# EAGLE board shield (EAGLE 9.3.0)
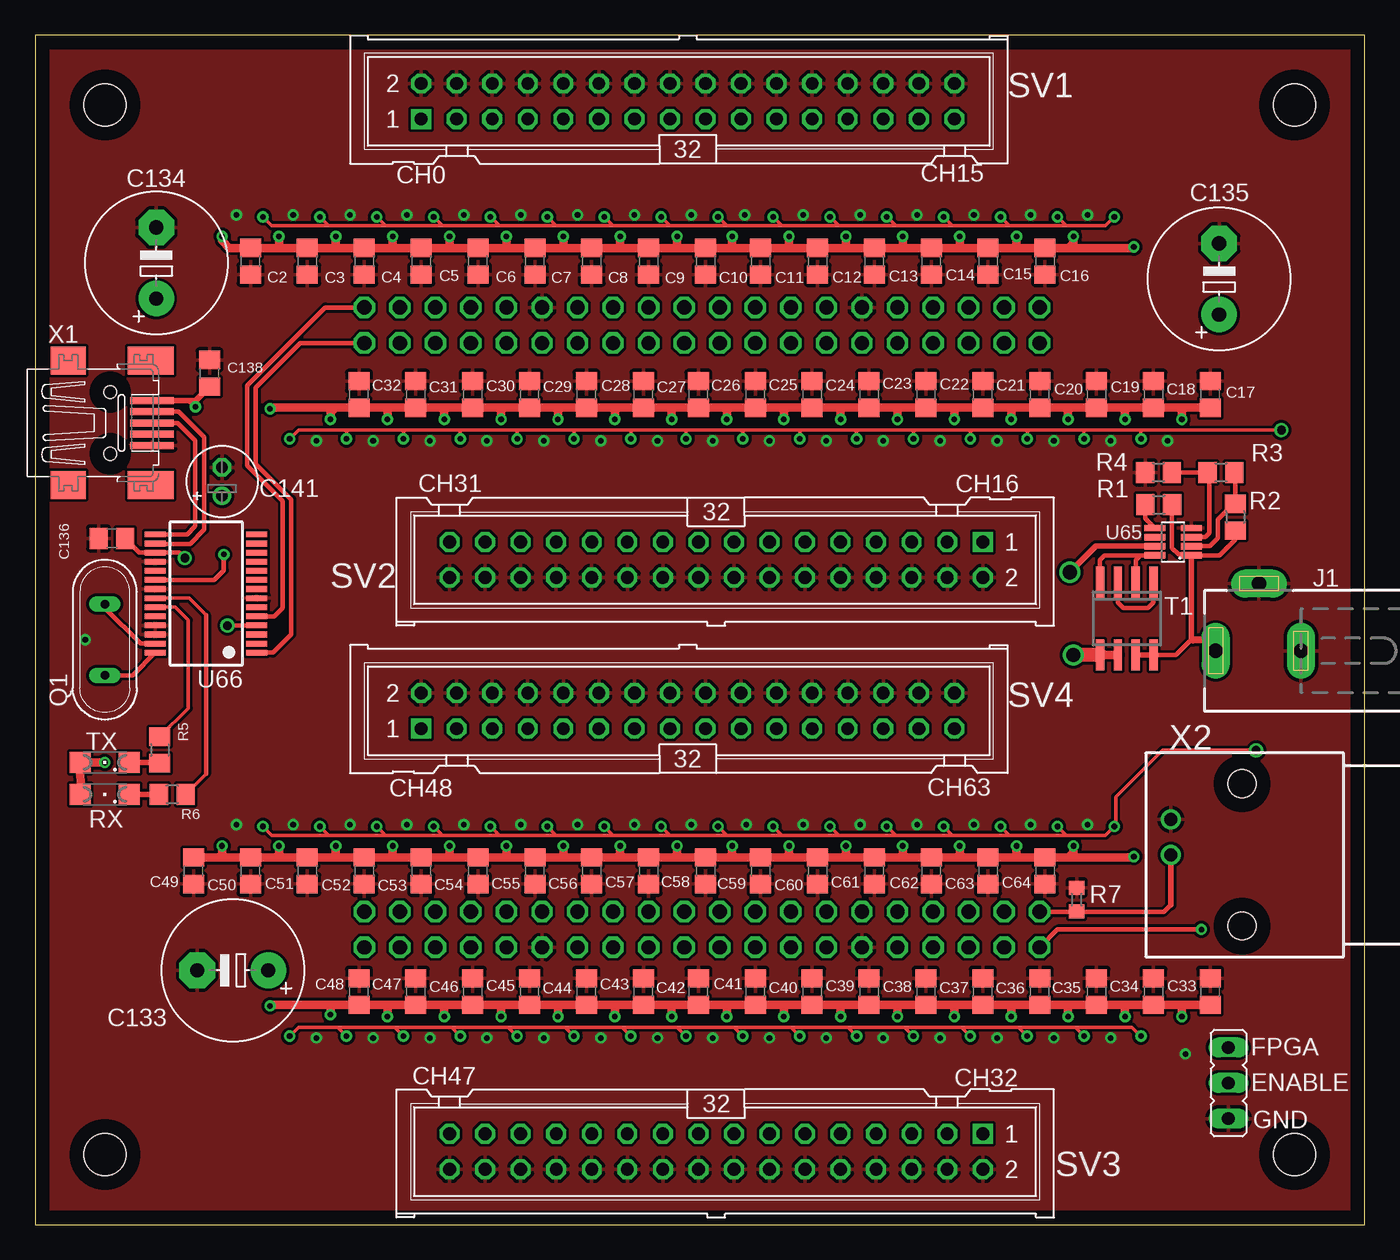
[diagram p5: board, top side]
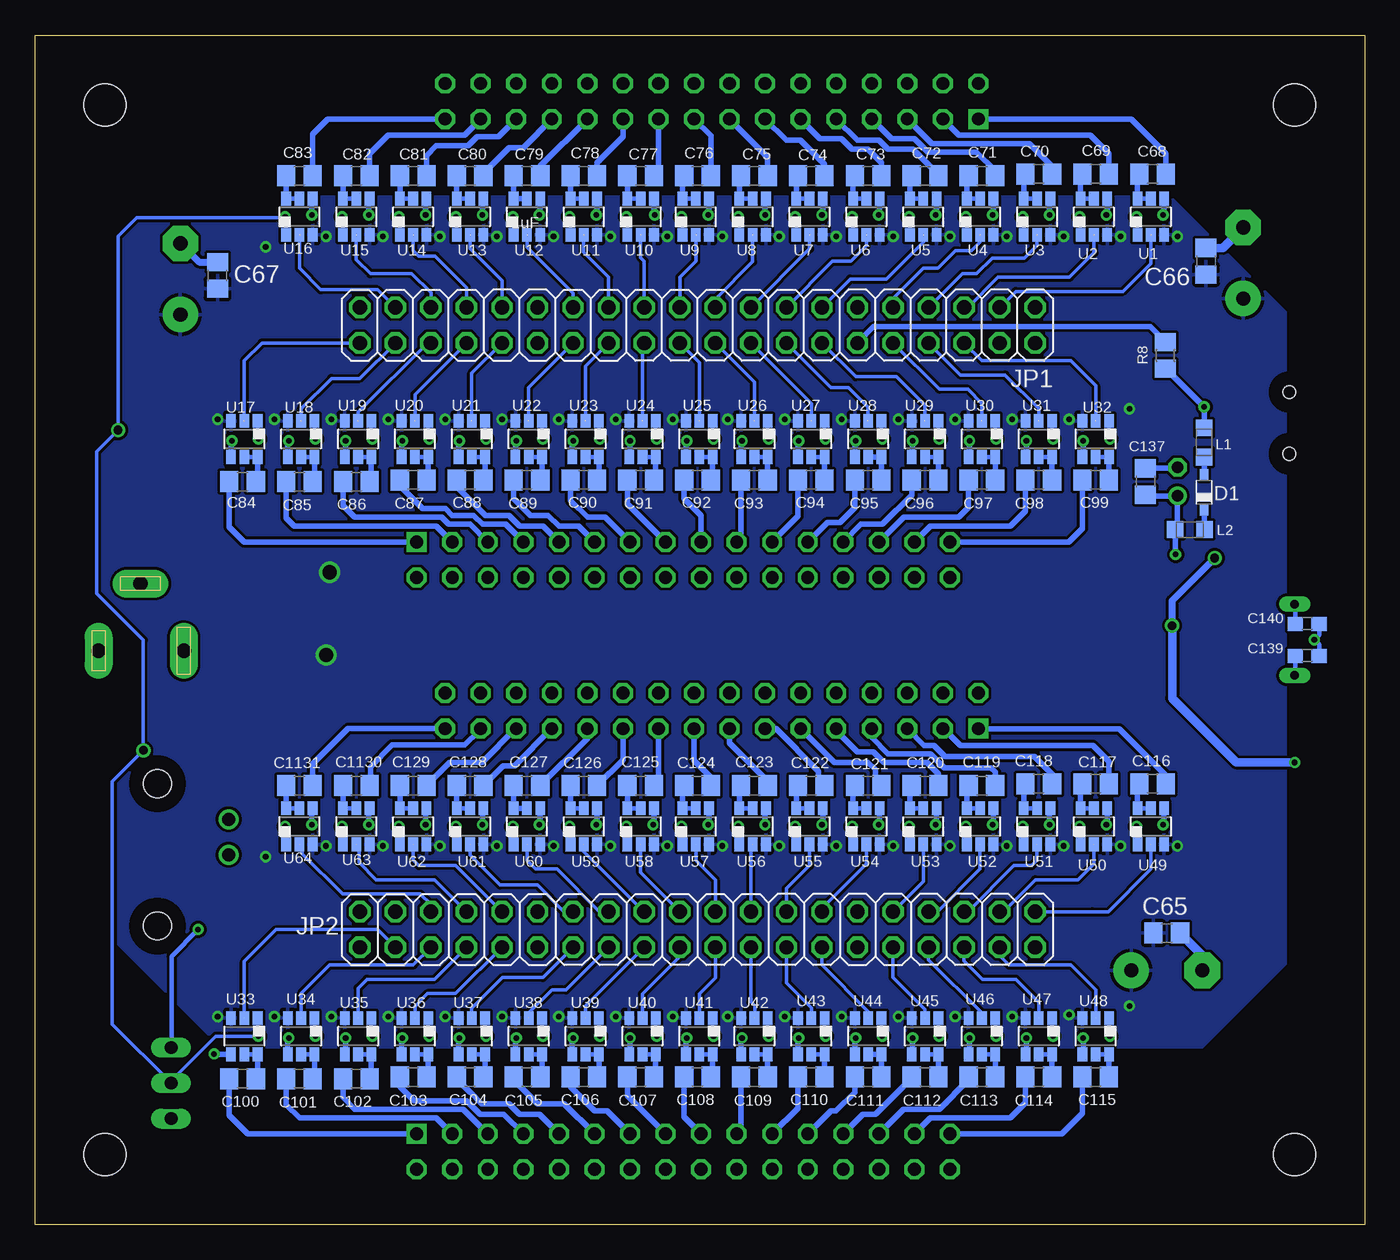
[diagram p6: board, bottom side, seen from below]

Size 95 x 85 mm. Coordinates in mm from the lower left corner, seen from the top.
Outline: 0,0 95,0 95,85 0,85 0,0
Copper layers (1*16): Top 0.035mm / dielectric 1.5mm / Bottom 0.035mm
Design rules "default *": minimum track width 6mil, minimum drill 0.35mm, track to track 8mil, track to pad 8mil, pad to pad 6mil, via to via 8mil, smd to smd 6mil, copper to edge 40mil, drill to drill 6mil, minimum pad ring 10mil, minimum via ring 8mil, stop-mask expansion 4mil, vias tented up to drill 0mil, thermal gap 10mil
Holes 3 mm at 5,5 5,80 90,80 90,5

## Footprints (pad centres in the part's own frame; a part is rotated, then mirrored left to right if it is on the bottom)
C0805 = smd 1.3 x 1.5: 1 -0.95,0; 2 0.95,0
E5-10,5 = drill 1.016 pad 2.54: + -2.54,0 | drill 1.016 pad 2.54 octagon: - 2.54,0
C0603 = smd 1.1 x 1: 1 -0.85,0; 2 0.85,0
E2-5 = drill 0.813 pad 1.27: + -1.016,0 | drill 0.813 pad 1.27 octagon: - 1.016,0
SOD323_ST = smd 0.8 x 0.6: A 1.25,0; C -1.25,0
DCJ0202 = drill 1.016 pad 2 long: 1 0,3.1; 2 4.8,0; 3 0,-3
2X20 = drill 1.016 octagon: 1 -24.13,-1.27; 2 -24.13,1.27; 3 -21.59,-1.27; 4 -21.59,1.27; 5 -19.05,-1.27; 6 -19.05,1.27; 7 -16.51,-1.27; 8 -16.51,1.27; 9 -13.97,-1.27; 10 -13.97,1.27; 11 -11.43,-1.27; 12 -11.43,1.27; 13 -8.89,-1.27; 14 -8.89,1.27; 15 -6.35,-1.27; 16 -6.35,1.27; 17 -3.81,-1.27; 18 -3.81,1.27; 19 -1.27,-1.27; 20 -1.27,1.27; 21 1.27,-1.27; 22 1.27,1.27; 23 3.81,-1.27; 24 3.81,1.27; 25 6.35,-1.27; 26 6.35,1.27; 27 8.89,-1.27; 28 8.89,1.27; 29 11.43,-1.27; 30 11.43,1.27; 31 13.97,-1.27; 32 13.97,1.27; 33 16.51,-1.27; 34 16.51,1.27; 35 19.05,-1.27; 36 19.05,1.27; 37 21.59,-1.27; 38 21.59,1.27; 39 24.13,-1.27; 40 24.13,1.27
JP2 = drill 0.914 long: 1 -2.54,0; 2 0,0; 3 2.54,0
SML0805 = smd 1.2 x 1.2: A 1.05,0; C -1.05,0
SML1206 = smd 1.5 x 1.5: A 1.75,0; C -1.75,0
QS = drill 0.61 long: 1 -2.54,0; 2 2.54,0
R0805 = smd 1.3 x 1.5: 1 -0.95,0; 2 0.95,0
R0603 = smd 1 x 1.1: 1 -0.85,0; 2 0.85,0
ML32 = drill 0.914 square: 1 -19.05,-1.27 | drill 0.914 octagon: 2 -19.05,1.27; 3 -16.51,-1.27; 4 -16.51,1.27; 5 -13.97,-1.27; 6 -13.97,1.27; 7 -11.43,-1.27; 8 -11.43,1.27; 9 -8.89,-1.27; 10 -8.89,1.27; 11 -6.35,-1.27; 12 -6.35,1.27; 13 -3.81,-1.27; 14 -3.81,1.27; 15 -1.27,-1.27; 16 -1.27,1.27; 17 1.27,-1.27; 18 1.27,1.27; 19 3.81,-1.27; 20 3.81,1.27; 21 6.35,-1.27; 22 6.35,1.27; 23 8.89,-1.27; 24 8.89,1.27; 25 11.43,-1.27; 26 11.43,1.27; 27 13.97,-1.27; 28 13.97,1.27; 29 16.51,-1.27; 30 16.51,1.27; 31 19.05,-1.27; 32 19.05,1.27
SO8 = smd 0.6 x 2.2: 1 -1.905,-2.6; 2 -0.635,-2.6; 3 0.635,-2.6; 4 1.905,-2.6; 5 1.905,2.6; 6 0.635,2.6; 7 -0.635,2.6; 8 -1.905,2.6
DBV_R-PDSO-G6 = smd 0.69 x 0.99: 1 -0.95,-1.29; 2 0,-1.29; 3 0.95,-1.29; 4 0.95,1.3; 5 0,1.3; 6 -0.95,1.3
TSOT23-8 = smd 0.457 x 1.499: 1 -0.95,-1.3; 2 -0.3,-1.3; 3 0.35,-1.3; 4 1,-1.3; 5 1,1.3; 6 0.35,1.3; 7 -0.3,1.3; 8 -0.95,1.3
SSOP28 = smd 0.4 x 1.5: 1 -4.225,-3.625; 2 -3.575,-3.625; 3 -2.925,-3.625; 4 -2.275,-3.625; 5 -1.625,-3.625; 6 -0.975,-3.625; 7 -0.325,-3.625; 8 0.325,-3.625; 9 0.975,-3.625; 10 1.625,-3.625; 11 2.275,-3.625; 12 2.925,-3.625; 13 3.575,-3.625; 14 4.225,-3.625; 15 4.225,3.625; 16 3.575,3.625; 17 2.925,3.625; 18 2.275,3.625; 19 1.625,3.625; 20 0.975,3.625; 21 0.325,3.625; 22 -0.325,3.625; 23 -0.975,3.625; 24 -1.625,3.625; 25 -2.275,3.625; 26 -2.925,3.625; 27 -3.575,3.625; 28 -4.225,3.625
32005-201 = smd 3.1 x 0.5: 1 3,1.6; 2 3,0.8; 3 3,0; 4 3,-0.8; 5 3,-1.6 | smd 2.5 x 2: M1 -3,-4.45; M2 -3,4.45 | smd 3.3 x 2: M3 2.9,4.45; M4 2.9,-4.45 | hole 0.914: 0,2.2; 0,-2.2
BNC_CUSTOM = drill 0.914 pad 1.27: 1 0,-5.08; 2 -2.54,-5.08 | hole 2: -5.08,0; 5.08,0

## Placement (x,y rotation side)
C2  1uF  [C0805]  15.4,68.83 270 top
C3  1uF  [C0805]  19.46,68.83 270 top
C4  1uF  [C0805]  23.53,68.83 270 top
C5  1uF  [C0805]  27.59,68.83 270 top
C6  1uF  [C0805]  31.66,68.83 270 top
C7  1uF  [C0805]  35.72,68.83 270 top
C8  1uF  [C0805]  39.78,68.83 270 top
C9  1uF  [C0805]  43.85,68.83 270 top
C10  1uF  [C0805]  47.91,68.83 270 top
C11  1uF  [C0805]  51.85,68.83 270 top
C12  1uF  [C0805]  55.91,68.83 270 top
C13  1uF  [C0805]  59.98,68.83 270 top
C14  1uF  [C0805]  64.04,68.83 270 top
C15  1uF  [C0805]  68.11,68.83 270 top
C16  1uF  [C0805]  72.17,68.83 270 top
C17  1uF  [C0805]  83.98,59.31 90 top
C18  1uF  [C0805]  79.92,59.31 90 top
C19  1uF  [C0805]  75.85,59.31 90 top
C20  1uF  [C0805]  71.79,59.31 90 top
C21  1uF  [C0805]  67.72,59.31 90 top
C22  1uF  [C0805]  63.66,59.31 90 top
C23  1uF  [C0805]  59.6,59.31 90 top
C24  1uF  [C0805]  55.53,59.31 90 top
C25  1uF  [C0805]  51.47,59.31 90 top
C26  1uF  [C0805]  47.4,59.31 90 top
C27  1uF  [C0805]  43.47,59.31 90 top
C28  1uF  [C0805]  39.4,59.31 90 top
C29  1uF  [C0805]  35.34,59.31 90 top
C30  1uF  [C0805]  31.27,59.31 90 top
C31  1uF  [C0805]  27.21,59.31 90 top
C32  1uF  [C0805]  23.15,59.31 90 top
C33  1uF  [C0805]  83.98,16.64 90 top
C34  1uF  [C0805]  79.92,16.64 90 top
C35  1uF  [C0805]  75.85,16.64 90 top
C36  1uF  [C0805]  71.79,16.64 90 top
C37  1uF  [C0805]  67.72,16.64 90 top
C38  1uF  [C0805]  63.66,16.64 90 top
C39  1uF  [C0805]  59.6,16.64 90 top
C40  1uF  [C0805]  55.53,16.64 90 top
C41  1uF  [C0805]  51.47,16.64 90 top
C42  1uF  [C0805]  47.4,16.64 90 top
C43  1uF  [C0805]  43.47,16.64 90 top
C44  1uF  [C0805]  39.4,16.64 90 top
C45  1uF  [C0805]  35.34,16.64 90 top
C46  1uF  [C0805]  31.27,16.64 90 top
C47  1uF  [C0805]  27.21,16.64 90 top
C48  1uF  [C0805]  23.15,16.64 90 top
C49  1uF  [C0805]  11.34,25.27 270 top
C50  1uF  [C0805]  15.4,25.27 270 top
C51  1uF  [C0805]  19.46,25.27 270 top
C52  1uF  [C0805]  23.53,25.27 270 top
C53  1uF  [C0805]  27.59,25.27 270 top
C54  1uF  [C0805]  31.66,25.27 270 top
C55  1uF  [C0805]  35.72,25.27 270 top
C56  1uF  [C0805]  39.78,25.27 270 top
C57  1uF  [C0805]  43.85,25.27 270 top
C58  1uF  [C0805]  47.91,25.27 270 top
C59  1uF  [C0805]  51.85,25.27 270 top
C60  1uF  [C0805]  55.91,25.27 270 top
C61  1uF  [C0805]  59.98,25.27 270 top
C62  1uF  [C0805]  64.04,25.27 270 top
C63  1uF  [C0805]  68.11,25.27 270 top
C64  1uF  [C0805]  72.17,25.27 270 top
C65  1uF  [C0805]  14.13,20.83 0 bottom
C66  1uF  [C0805]  11.34,68.83 90 bottom
C67  1uF  [C0805]  81.95,67.82 90 bottom
C68  [C0805]  15.15,75.06 0 bottom
C69  [C0805]  19.21,75.06 0 bottom
C70  [C0805]  23.27,75.06 0 bottom
C71  [C0805]  27.34,74.93 0 bottom
C72  [C0805]  31.4,74.93 0 bottom
C73  [C0805]  35.47,74.93 0 bottom
C74  [C0805]  39.53,74.93 0 bottom
C75  [C0805]  43.59,74.93 0 bottom
C76  [C0805]  47.66,74.93 0 bottom
C77  [C0805]  51.72,74.93 0 bottom
C78  [C0805]  55.79,74.93 0 bottom
C79  [C0805]  59.85,74.93 0 bottom
C80  [C0805]  63.91,74.93 0 bottom
C81  [C0805]  67.98,74.93 0 bottom
C82  [C0805]  72.04,74.93 0 bottom
C83  [C0805]  76.11,74.93 0 bottom
C84  [C0805]  80.17,53.09 180 bottom
C85  [C0805]  76.11,53.09 180 bottom
C86  [C0805]  72.04,53.09 180 bottom
C87  [C0805]  67.98,53.21 180 bottom
C88  [C0805]  63.91,53.21 180 bottom
C89  [C0805]  59.85,53.21 180 bottom
C90  [C0805]  55.79,53.21 180 bottom
C91  [C0805]  51.72,53.21 180 bottom
C92  [C0805]  47.66,53.21 180 bottom
C93  [C0805]  43.59,53.21 180 bottom
C94  [C0805]  39.53,53.21 180 bottom
C95  [C0805]  35.47,53.21 180 bottom
C96  [C0805]  31.4,53.21 180 bottom
C97  [C0805]  27.34,53.21 180 bottom
C98  [C0805]  23.27,53.21 180 bottom
C99  [C0805]  19.21,53.21 180 bottom
C100  [C0805]  80.17,10.41 180 bottom
C101  [C0805]  76.11,10.41 180 bottom
C102  [C0805]  72.04,10.41 180 bottom
C103  [C0805]  67.98,10.54 180 bottom
C104  [C0805]  63.91,10.54 180 bottom
C105  [C0805]  59.85,10.54 180 bottom
C106  [C0805]  55.79,10.54 180 bottom
C107  [C0805]  51.72,10.54 180 bottom
C108  [C0805]  47.66,10.54 180 bottom
C109  [C0805]  43.59,10.54 180 bottom
C110  [C0805]  39.53,10.54 180 bottom
C111  [C0805]  35.47,10.54 180 bottom
C112  [C0805]  31.4,10.54 180 bottom
C113  [C0805]  27.34,10.54 180 bottom
C114  [C0805]  23.27,10.54 180 bottom
C115  [C0805]  19.21,10.54 180 bottom
C116  [C0805]  15.15,31.5 0 bottom
C117  [C0805]  19.21,31.5 0 bottom
C118  [C0805]  23.27,31.5 0 bottom
C119  [C0805]  27.34,31.37 0 bottom
C120  [C0805]  31.4,31.37 0 bottom
C121  [C0805]  35.47,31.37 0 bottom
C122  [C0805]  39.53,31.37 0 bottom
C123  [C0805]  43.59,31.37 0 bottom
C124  [C0805]  47.66,31.37 0 bottom
C125  [C0805]  51.72,31.37 0 bottom
C126  [C0805]  55.79,31.37 0 bottom
C127  [C0805]  59.85,31.37 0 bottom
C128  [C0805]  63.91,31.37 0 bottom
C129  [C0805]  67.98,31.37 0 bottom
C133  220uF  [E5-10,5]  14.13,18.16 180 top
C134  220uF  [E5-10,5]  8.67,68.71 90 top
C135  220uF  [E5-10,5]  84.61,67.56 90 top
C136  100nF  [C0805]  5.49,49.02 180 top
C137  100nF  [C0805]  15.65,53.09 90 bottom
C138  10nF  [C0805]  12.48,60.83 90 top
C139  18pF  [C0603]  4.1,40.64 0 bottom
C140  18pF  [C0603]  4.1,42.93 0 bottom
C141  4.7uF  [E2-5]  13.37,53.09 90 top
C1130  [C0805]  72.04,31.37 0 bottom
C1131  [C0805]  76.11,31.37 0 bottom
D1  BAT60J  [SOD323_ST]  11.46,52.32 90 bottom
J1  DC_JACK  [DCJ0202]  87.46,41 90 top
JP1  [2X20]  47.66,64.26 180 bottom
JP2  [2X20]  47.66,21.08 0 bottom
JUMPER  JUMPER_3  [JP2]  85.28,10.11 90 top
L1  FERRITE  [SML0805]  11.46,55.88 90 bottom
L2  POLYFUSE  [SML0805]  12.48,49.66 0 bottom
LED1  [SML1206]  4.99,33.02 180 top
LED2  [SML1206]  4.99,30.73 180 top
Q1  12 MHz  [QS]  4.99,41.78 270 top
R1  510k  [R0805]  80.3,51.44 0 top
R2  2M1  [R0805]  85.76,50.55 270 top
R3  168k  [R0805]  84.74,53.75 0 top
R4  59k  [R0805]  80.27,53.75 0 top
R5  65R  [R0805]  8.92,33.91 270 top
R6  65R  [R0805]  9.81,30.73 180 top
R7  50R  [R0603]  74.43,23.22 90 top
R8  0R  [R0805]  14.22,62.1 90 bottom
SV1  ML32  [ML32]  46.64,80.26 0 top
SV2  ML32  [ML32]  48.67,47.5 180 top
SV3  ML32  [ML32]  48.67,5.21 180 top
SV4  ML32  [ML32]  46.64,36.7 0 top
T1  PHKD3NQ10T  [SO8]  78.01,43.31 180 top
U1  UCC27531  [DBV_R-PDSO-G6]  15.27,72.01 0 bottom
U2  UCC27531  [DBV_R-PDSO-G6]  19.34,72.01 0 bottom
U3  UCC27531  [DBV_R-PDSO-G6]  23.4,72.01 0 bottom
U4  UCC27531  [DBV_R-PDSO-G6]  27.46,72.01 0 bottom
U5  UCC27531  [DBV_R-PDSO-G6]  31.53,72.01 0 bottom
U6  UCC27531  [DBV_R-PDSO-G6]  35.59,72.01 0 bottom
U7  UCC27531  [DBV_R-PDSO-G6]  39.66,72.01 0 bottom
U8  UCC27531  [DBV_R-PDSO-G6]  43.72,72.01 0 bottom
U9  UCC27531  [DBV_R-PDSO-G6]  47.78,72.01 0 bottom
U10  UCC27531  [DBV_R-PDSO-G6]  51.72,72.01 0 bottom
U11  UCC27531  [DBV_R-PDSO-G6]  55.79,72.01 0 bottom
U12  UCC27531  [DBV_R-PDSO-G6]  59.85,72.01 0 bottom
U13  UCC27531  [DBV_R-PDSO-G6]  63.91,72.01 0 bottom
U14  UCC27531  [DBV_R-PDSO-G6]  67.98,72.01 0 bottom
U15  UCC27531  [DBV_R-PDSO-G6]  72.04,72.01 0 bottom
U16  UCC27531  [DBV_R-PDSO-G6]  76.11,72.01 0 bottom
U17  UCC27531  [DBV_R-PDSO-G6]  80.04,56.13 180 bottom
U18  UCC27531  [DBV_R-PDSO-G6]  75.98,56.13 180 bottom
U19  UCC27531  [DBV_R-PDSO-G6]  71.92,56.13 180 bottom
U20  UCC27531  [DBV_R-PDSO-G6]  67.85,56.13 180 bottom
U21  UCC27531  [DBV_R-PDSO-G6]  63.79,56.13 180 bottom
U22  UCC27531  [DBV_R-PDSO-G6]  59.72,56.13 180 bottom
U23  UCC27531  [DBV_R-PDSO-G6]  55.66,56.13 180 bottom
U24  UCC27531  [DBV_R-PDSO-G6]  51.59,56.13 180 bottom
U25  UCC27531  [DBV_R-PDSO-G6]  47.53,56.13 180 bottom
U26  UCC27531  [DBV_R-PDSO-G6]  43.59,56.13 180 bottom
U27  UCC27531  [DBV_R-PDSO-G6]  39.53,56.13 180 bottom
U28  UCC27531  [DBV_R-PDSO-G6]  35.47,56.13 180 bottom
U29  UCC27531  [DBV_R-PDSO-G6]  31.4,56.13 180 bottom
U30  UCC27531  [DBV_R-PDSO-G6]  27.34,56.13 180 bottom
U31  UCC27531  [DBV_R-PDSO-G6]  23.27,56.13 180 bottom
U32  UCC27531  [DBV_R-PDSO-G6]  19.21,56.13 180 bottom
U33  UCC27531  [DBV_R-PDSO-G6]  80.04,13.46 180 bottom
U34  UCC27531  [DBV_R-PDSO-G6]  75.98,13.46 180 bottom
U35  UCC27531  [DBV_R-PDSO-G6]  71.92,13.46 180 bottom
U36  UCC27531  [DBV_R-PDSO-G6]  67.85,13.46 180 bottom
U37  UCC27531  [DBV_R-PDSO-G6]  63.79,13.46 180 bottom
U38  UCC27531  [DBV_R-PDSO-G6]  59.72,13.46 180 bottom
U39  UCC27531  [DBV_R-PDSO-G6]  55.66,13.46 180 bottom
U40  UCC27531  [DBV_R-PDSO-G6]  51.59,13.46 180 bottom
U41  UCC27531  [DBV_R-PDSO-G6]  47.53,13.46 180 bottom
U42  UCC27531  [DBV_R-PDSO-G6]  43.59,13.46 180 bottom
U43  UCC27531  [DBV_R-PDSO-G6]  39.53,13.46 180 bottom
U44  UCC27531  [DBV_R-PDSO-G6]  35.47,13.46 180 bottom
U45  UCC27531  [DBV_R-PDSO-G6]  31.4,13.46 180 bottom
U46  UCC27531  [DBV_R-PDSO-G6]  27.34,13.46 180 bottom
U47  UCC27531  [DBV_R-PDSO-G6]  23.27,13.46 180 bottom
U48  UCC27531  [DBV_R-PDSO-G6]  19.21,13.46 180 bottom
U49  UCC27531  [DBV_R-PDSO-G6]  15.27,28.45 0 bottom
U50  UCC27531  [DBV_R-PDSO-G6]  19.34,28.45 0 bottom
U51  UCC27531  [DBV_R-PDSO-G6]  23.4,28.45 0 bottom
U52  UCC27531  [DBV_R-PDSO-G6]  27.46,28.45 0 bottom
U53  UCC27531  [DBV_R-PDSO-G6]  31.53,28.45 0 bottom
U54  UCC27531  [DBV_R-PDSO-G6]  35.59,28.45 0 bottom
U55  UCC27531  [DBV_R-PDSO-G6]  39.66,28.45 0 bottom
U56  UCC27531  [DBV_R-PDSO-G6]  43.72,28.45 0 bottom
U57  UCC27531  [DBV_R-PDSO-G6]  47.78,28.45 0 bottom
U58  UCC27531  [DBV_R-PDSO-G6]  51.72,28.45 0 bottom
U59  UCC27531  [DBV_R-PDSO-G6]  55.79,28.45 0 bottom
U60  UCC27531  [DBV_R-PDSO-G6]  59.85,28.45 0 bottom
U61  UCC27531  [DBV_R-PDSO-G6]  63.91,28.45 0 bottom
U62  UCC27531  [DBV_R-PDSO-G6]  67.98,28.45 0 bottom
U63  UCC27531  [DBV_R-PDSO-G6]  72.04,28.45 0 bottom
U64  UCC27531  [DBV_R-PDSO-G6]  76.11,28.45 0 bottom
U65  LTC4365  [TSOT23-8]  81.31,48.77 90 top
U66  FT232R  [SSOP28]  12.22,45.09 90 top
X1  MINI-USB  [32005-201]  5.37,57.28 0 top
X2  BNC  [BNC_CUSTOM]  86.24,26.42 270 top

## Tracks (layer width: path | path; a pad name or v marks a point on that pad's centre or on a via)
3V3  (via drill 0.4, 0.61)
  Top 0.305: v10.7,47.62 10.32,48.01 U66.17 7.46,48.01 C136.1 | v13.75,42.8 15.84,42.8 U66.4
  Top 0.61: LED2.A 3.26,30.76 LED1.A v4.99,33.02
  Bottom 0.508: v13.75,42.8 13.75,44.58 v10.7,47.62
  Bottom 0.61: v13.75,42.8 13.75,37.59 9.18,33.02 v4.99,33.02
!RXLED!
  Top 0.254: U66.22 11.03,44.76 12.22,43.56 | 12.22,32.2 R6.1
  Top 0.305: 12.22,43.56 12.22,32.2
!TXLED!
  Top 0.254: R5.1 10.96,36.89 10.96,43.18 10.03,44.11 U66.23
BNC
  Top 0.152: R7.1 72.21,22.37 72.19,22.35
  Top 0.305: JP2.2 72.19,22.35 80.68,22.35 81.16,22.84
  Top 0.406: 81.16,22.84 X2.1
D+
  Top 0.305: X1.3 10.19,57.28 11.46,56.01 11.46,49.91 10.86,49.31 U66.15
D-
  Top 0.305: X1.2 10.28,58.08 12.1,56.26 12.1,49.66 11.08,48.64 8.62,48.64 U66.16
ENABLE  (via drill 0.4 pad 0.61, 0.61)
  Top 0.254: 79.92,56.77 79.03,56.77 v79.03,56.13 | 79.92,56.77 81.5,56.77 v89.06,56.77 | v18.19,13.46 18.83,14.1 21.11,14.1 | v79.03,13.46 78.39,14.1 73.69,14.1 | 73.69,14.1 69.88,14.1 | 69.88,14.1 65.56,14.1 | 65.56,14.1 61.63,14.1 | 61.63,14.1 57.31,14.1 | 57.31,14.1 53.25,14.1 | 53.25,14.1 49.69,14.1 | 49.69,14.1 45.12,14.1 | 45.12,14.1 41.44,14.1 | 41.44,14.1 37.37,14.1 | 37.37,14.1 33.43,14.1 | 33.43,14.1 28.61,14.1 | 28.61,14.1 25.18,14.1 | 25.18,14.1 21.11,14.1 | v74.96,13.46 74.33,14.1 73.69,14.1 | v70.9,13.46 70.26,14.1 69.88,14.1 | v66.83,13.46 66.2,14.1 65.56,14.1 | v62.77,13.46 62.14,14.1 61.63,14.1 | v58.71,13.46 58.07,14.1 57.31,14.1 | v54.64,13.46 54.01,14.1 53.25,14.1 | v50.58,13.46 49.94,14.1 49.69,14.1 | v46.52,13.46 45.88,14.1 45.12,14.1 | v42.58,13.46 41.94,14.1 41.44,14.1 | v38.51,13.46 37.88,14.1 37.37,14.1 | v34.45,13.46 33.81,14.1 33.43,14.1 | v30.39,13.46 29.75,14.1 28.61,14.1 | v26.32,13.46 25.69,14.1 25.18,14.1 | v22.26,13.46 21.62,14.1 21.11,14.1 | v16.29,28.45 16.92,27.81 21.62,27.81 | 74.71,27.81 76.49,27.81 v77.12,28.45 77.22,28.55 77.22,30.56 80.58,33.91 87.23,33.91 v87.26,33.88 | 74.71,27.81 70.26,27.81 | 70.26,27.81 66.71,27.81 | 66.71,27.81 62.14,27.81 | 62.14,27.81 58.07,27.81 | 58.07,27.81 54.39,27.81 | 54.39,27.81 49.69,27.81 | 49.69,27.81 46.39,27.81 | 46.39,27.81 41.69,27.81 | 41.69,27.81 37.62,27.81 | 37.62,27.81 33.69,27.81 | 33.69,27.81 29.37,27.81 | 29.37,27.81 25.69,27.81 | 25.69,27.81 25.16,27.81 21.62,27.81 | v20.35,28.45 20.99,27.81 21.62,27.81 | v24.42,28.45 25.05,27.81 25.69,27.81 | v28.48,28.45 29.12,27.81 29.37,27.81 | v32.55,28.45 33.18,27.81 33.69,27.81 | v36.61,28.45 37.24,27.81 37.62,27.81
  Top 0.254: v40.67,28.45 41.31,27.81 41.69,27.81 | v44.74,28.45 45.37,27.81 46.39,27.81 | v48.8,28.45 49.44,27.81 49.69,27.81 | v52.74,28.45 53.37,27.81 54.39,27.81 | v56.8,28.45 57.44,27.81 58.07,27.81 | v60.87,28.45 61.5,27.81 62.14,27.81 | v64.93,28.45 65.56,27.81 66.71,27.81 | v68.99,28.45 69.63,27.81 70.26,27.81 | v73.06,28.45 73.69,27.81 74.71,27.81 | v18.19,56.13 18.83,56.77 21.37,56.77 | 21.37,56.77 25.31,56.77 | 25.31,56.77 29.5,56.77 | 29.5,56.77 33.43,56.77 | 33.43,56.77 37.37,56.77 | 37.37,56.77 41.56,56.77 | 41.56,56.77 45.63,56.77 | 45.63,56.77 49.82,56.77 | 49.82,56.77 53.75,56.77 | 53.75,56.77 57.44,56.77 | 57.44,56.77 61.37,56.77 | 61.37,56.77 65.95,56.77 | 65.95,56.77 70.14,56.77 | 70.14,56.77 73.82,56.77 | 73.82,56.77 79.92,56.77 | v74.96,56.13 74.96,56.77 73.82,56.77 | v70.9,56.13 70.9,56.77 70.14,56.77 | v66.83,56.13 66.83,56.77 65.95,56.77 | v62.77,56.13 62.77,56.77 61.37,56.77 | v58.71,56.13 58.71,56.77 57.44,56.77 | v54.64,56.13 54.64,56.77 53.75,56.77 | 49.82,56.77 50.45,56.77 50.58,56.64 v50.58,56.13 | v46.52,56.13 46.52,56.77 45.63,56.77 | v42.58,56.13 42.58,56.77 41.56,56.77 | v38.51,56.13 38.51,56.77 37.37,56.77 | v34.45,56.13 34.45,56.77 33.43,56.77 | v30.39,56.13 30.39,56.77 29.5,56.77 | v26.32,56.13 26.32,56.77 25.31,56.77 | v22.26,56.13 22.26,56.77 21.37,56.77 | v77.12,72.01 76.49,71.37 73.95,71.37 | v16.29,72.01 16.92,71.37 21.5,71.37 | 73.95,71.37 70.01,71.37 | 70.01,71.37 66.07,71.37 | 66.07,71.37 61.88,71.37 | 61.88,71.37 58.07,71.37 | 58.07,71.37 53.75,71.37 | 53.75,71.37 49.69,71.37 | 49.69,71.37 46.01,71.37 | 46.01,71.37 41.94,71.37 | 41.94,71.37 37.88,71.37 | 37.88,71.37 33.56,71.37 | 33.56,71.37 29.62,71.37
  Top 0.254: 29.62,71.37 25.31,71.37 | 25.31,71.37 21.5,71.37 | v20.35,72.01 20.99,71.37 21.5,71.37 | v24.42,72.01 25.05,71.37 25.31,71.37 | v28.48,72.01 29.12,71.37 29.62,71.37 | v32.55,72.01 33.18,71.37 33.56,71.37 | v36.61,72.01 37.24,71.37 37.88,71.37 | v40.67,72.01 41.31,71.37 41.94,71.37 | v44.74,72.01 45.37,71.37 46.01,71.37 | v48.8,72.01 49.44,71.37 49.69,71.37 | v52.74,72.01 53.37,71.37 53.75,71.37 | v56.8,72.01 57.44,71.37 58.07,71.37 | v60.87,72.01 61.5,71.37 61.88,71.37 | v64.93,72.01 65.56,71.37 66.07,71.37 | v68.99,72.01 69.63,71.37 70.01,71.37 | v73.06,72.01 73.69,71.37 73.95,71.37
  Bottom 0.254: U54.1 36.54,28.38 v36.61,28.45 | U60.1 60.8,28.38 v60.87,28.45 | U62.1 68.93,28.38 v68.99,28.45 | U63.1 72.99,28.38 v73.06,28.45 | U64.1 77.06,28.38 v77.12,28.45 | U49.1 16.22,28.38 v16.29,28.45 | U50.1 20.29,28.38 v20.35,28.45 | U51.1 24.35,28.38 v24.42,28.45 | U52.1 28.41,28.38 v28.48,28.45 | U53.1 32.48,28.38 v32.55,28.45 | U55.1 40.61,28.38 v40.67,28.45 | U56.1 44.67,28.38 v44.74,28.45 | U57.1 48.73,28.38 v48.8,28.45 | U58.1 52.67,28.38 v52.74,28.45 | U59.1 56.74,28.38 v56.8,28.45 | U61.1 64.86,28.38 v64.93,28.45 | U38.1 58.77,13.53 v58.71,13.46 | U44.1 34.52,13.53 v34.45,13.46 | U46.1 26.39,13.53 v26.32,13.46 | U47.1 22.32,13.53 v22.26,13.46 | U48.1 18.26,13.53 v18.19,13.46 | U33.1 79.09,13.53 v79.03,13.46 82.08,13.46 85.28,10.26 JUMPER.2 89.48,14.31 89.48,31.66 v87.26,33.88 87.26,41.76 90.58,45.09 90.58,55.24 89.19,56.64 v89.06,56.77 89.06,70.61 88.81,70.87 87.73,71.94 77.06,71.94 | U34.1 75.03,13.53 v74.96,13.46 | U35.1 70.97,13.53 v70.9,13.46 | U36.1 66.9,13.53 v66.83,13.46 | U37.1 62.84,13.53 v62.77,13.46 | U39.1 54.71,13.53 v54.64,13.46 | U40.1 50.65,13.53 v50.58,13.46 | U41.1 46.58,13.53 v46.52,13.46 | U42.1 42.64,13.53 v42.58,13.46 | U43.1 38.58,13.53 v38.51,13.46 | U45.1 30.45,13.53 v30.39,13.46 | U22.1 58.77,56.2 v58.71,56.13 | U28.1 34.52,56.2 v34.45,56.13 | U30.1 26.39,56.2 v26.32,56.13 | U31.1 22.32,56.2 v22.26,56.13 | U32.1 18.26,56.2 v18.19,56.13 | U17.1 79.09,56.2 v79.03,56.13 | U18.1 75.03,56.2 v74.96,56.13 | U19.1 70.97,56.2 v70.9,56.13 | U20.1 66.9,56.2 v66.83,56.13 | U21.1 62.84,56.2 v62.77,56.13 | U23.1 54.71,56.2 v54.64,56.13 | U24.1 50.65,56.2 v50.58,56.13 | U25.1 46.58,56.2 v46.52,56.13
  Bottom 0.254: U26.1 42.64,56.2 v42.58,56.13 | U27.1 38.58,56.2 v38.51,56.13 | U29.1 30.45,56.2 v30.39,56.13 | U6.1 36.54,71.94 v36.61,72.01 | U12.1 60.8,71.94 v60.87,72.01 | U14.1 68.93,71.94 v68.99,72.01 | U15.1 72.99,71.94 v73.06,72.01 | U16.1 77.06,71.94 | 77.06,71.94 v77.12,72.01 | U1.1 16.22,71.94 v16.29,72.01 | U2.1 20.29,71.94 v20.35,72.01 | U3.1 24.35,71.94 v24.42,72.01 | U4.1 28.41,71.94 v28.48,72.01 | U5.1 32.48,71.94 v32.55,72.01 | U7.1 40.61,71.94 v40.67,72.01 | U8.1 44.67,71.94 v44.74,72.01 | U9.1 48.73,71.94 v48.8,72.01 | U10.1 52.67,71.94 v52.74,72.01 | U11.1 56.74,71.94 v56.8,72.01 | U13.1 64.86,71.94 v64.93,72.01
FPGA-EN  (via drill 0.4)
  Top 0.305: v83.34,21.08 73.06,21.08 JP2.1
  Bottom 0.305: v83.34,21.08 85.25,19.18 85.25,12.68 JUMPER.3
GND  (via drill 0.4, 0.4 pad 0.61)
  Bottom 0.305: C139.2 3.25,41.44 v3.59,41.78 3.25,42.12 C140.2
  Bottom 0.406: v75.22,28.57 75.22,29.69 U64.4 | v71.15,28.57 71.15,29.69 U63.4 | U62.4 arc-90 67.09,29.69 v67.09,28.57 | U61.4 arc-90 63.02,29.69 v63.02,28.57 | v54.9,28.57 arc-90 54.84,28.64 U59.4 | U60.4 58.9,28.64 v58.96,28.57 | U58.4 50.77,28.64 v50.83,28.57 | U57.4 46.84,28.64 v46.9,28.57 | U56.4 42.83,29.69 v42.83,28.57 | U55.4 38.71,28.64 v38.77,28.57 | U54.4 34.64,28.64 v34.7,28.57 | U53.4 30.58,28.64 v30.64,28.57 | U49.4 14.32,28.64 v14.38,28.57 | U50.4 18.39,28.64 v18.45,28.57 | U51.4 22.51,29.69 v22.51,28.57 | U52.4 26.52,28.64 v26.58,28.57 | v20.1,13.34 20.1,12.22 U48.4 | v24.16,13.34 24.16,12.22 U47.4 | U46.4 arc-90 28.23,12.22 v28.23,13.34 | U45.4 arc-90 32.29,12.22 v32.29,13.34 | v40.42,13.34 arc-90 40.48,13.27 U43.4 | U44.4 36.42,13.27 v36.35,13.34 | U42.4 44.54,13.27 v44.48,13.34 | U41.4 48.48,13.27 v48.42,13.34 | U40.4 52.48,12.22 v52.48,13.34 | U39.4 56.61,13.27 v56.55,13.34 | U38.4 60.67,13.27 v60.61,13.34 | U37.4 64.74,13.27 v64.68,13.34 | v82.2,12.19 82.17,12.16 U33.4 | U34.4 76.93,13.27 v76.87,13.34 | U35.4 72.8,12.22 v72.8,13.34 | U36.4 68.8,13.27 v68.74,13.34 | v20.1,56.01 20.1,54.9 U32.4 | v24.16,56.01 24.16,54.9 U31.4 | U30.4 arc-90 28.23,54.9 v28.23,56.01 | U29.4 arc-90 32.29,54.9 v32.29,56.01 | v40.42,56.01 arc-90 40.48,55.95 U27.4 | U28.4 36.42,55.95 v36.35,56.01 | U26.4 44.54,55.95 v44.48,56.01 | U25.4 48.48,55.95 v48.42,56.01 | U24.4 52.48,54.9 v52.48,56.01 | U23.4 56.61,55.95 v56.55,56.01 | U22.4 60.67,55.95 v60.61,56.01 | U21.4 64.74,55.95 v64.68,56.01 | U17.4 80.99,55.95 v80.93,56.01 | U18.4 76.93,55.95 v76.87,56.01 | U19.4 72.8,54.9 v72.8,56.01 | U20.4 68.8,55.95 v68.74,56.01 | v75.22,72.14 75.22,73.25 U16.4
  Bottom 0.406: v71.15,72.14 71.15,73.25 U15.4 | U14.4 arc-90 67.09,73.25 v67.09,72.14 | U13.4 arc-90 63.02,73.25 v63.02,72.14 | v54.9,72.14 arc-90 54.84,72.2 U11.4 | U12.4 58.9,72.2 v58.96,72.14 | U10.4 50.77,72.2 v50.71,72.14 | U9.4 46.84,72.2 v46.9,72.14 | U8.4 42.83,73.25 v42.83,72.14 | U7.4 38.71,72.2 v38.77,72.14 | U6.4 34.64,72.2 v34.7,72.14 | U5.4 30.58,72.2 v30.64,72.14 | U1.4 14.32,72.2 v14.38,72.14 | U2.4 18.39,72.2 v18.45,72.14 | U3.4 22.51,73.25 v22.51,72.14 | U4.4 26.52,72.2 v26.58,72.14 | C137.2 13.43,54.04 C141.-
  Bottom 0.508: C67.2 83.28,68.77 C135.-
  Bottom 0.61: C134.- 10.13,69.78 C66.2 | C133.- 11.59,19.24 C65.2
  pour Top: 0,0 95.05,0 95.05,85.36 0,85.36
IN0
  Bottom 0.254: U1.2 15.27,68.67 17.27,66.67 24.93,66.67 JP1.3
IN1
  Bottom 0.254: U2.2 19.34,69.44 21.08,67.69 26.2,67.69 28.35,65.53 JP1.5
IN2
  Bottom 0.254: U3.2 23.4,69.96 24.29,69.07 26.6,69.07 27.72,67.94 28.73,67.94 JP1.7
IN3
  Bottom 0.254: JP1.9 33.69,66.17 31.53,68.33 30.49,68.33 29.24,69.58 28.1,69.58 27.46,70.21 U4.2
IN4
  Bottom 0.254: JP1.13 36.74,67.56 34.18,67.56 31.53,70.21 U5.2
IN5
  Bottom 0.254: U6.2 35.59,69.94 36.7,68.83 38.01,68.83 JP1.15
IN6
  Bottom 0.254: JP1.17 39.66,69.72 U7.2
IN7
  Bottom 0.254: JP1.19 46.39,66.13 43.72,68.8 U8.2
IN8
  Bottom 0.254: U9.2 47.78,68.83 48.93,67.69 JP1.21
IN9
  Bottom 0.254: U10.2 51.72,69.09 51.47,68.83 JP1.23
IN10
  Bottom 0.254: U11.2 55.79,69.47 54.01,67.69 JP1.25
IN11
  Bottom 0.254: U12.2 59.85,69.85 56.55,66.55 JP1.27
IN12
  Bottom 0.254: U13.2 63.91,69.72 62.06,67.86 61.63,67.44 JP1.31
IN13
  Bottom 0.254: U14.2 67.98,69.6 67.58,69.2 66.4,69.2 64.17,66.96 JP1.33
IN14
  Bottom 0.254: U15.2 72.04,68.96 71.03,67.94 68.07,67.94 66.71,66.58 JP1.35
IN15
  Bottom 0.254: U16.2 76.11,68.33 74.58,66.8 71.37,66.8 70.52,66.8 JP1.37
IN16
  Bottom 0.254: JP1.40 78.77,62.99 80.04,61.72 U17.2
IN17
  Bottom 0.254: U18.2 75.98,58.29 73.82,60.45 71.79,60.45 JP1.38
IN18
  Bottom 0.254: U19.2 71.92,58.04 66.96,62.99 JP1.36
IN19
  Bottom 0.254: U20.2 67.85,59.31 JP1.34
IN20
  Bottom 0.254: U21.2 63.79,60.83 JP1.32
IN21
  Bottom 0.254: U22.2 59.72,59.82 JP1.28
IN22
  Bottom 0.254: U23.2 55.66,61.34 JP1.26
IN23
  Bottom 0.254: U24.2 51.59,62.87 JP1.24
IN24
  Bottom 0.254: U25.2 47.53,61.59 JP1.22
IN25
  Bottom 0.254: U26.2 43.59,60.2 JP1.20
IN26
  Bottom 0.254: U27.2 39.53,58.67 JP1.18
IN27
  Bottom 0.254: U28.2 35.47,58.42 36.86,59.82 38.13,59.82 JP1.16
IN28
  Bottom 0.254: U29.2 31.4,58.55 33.43,60.58 36.35,60.58 JP1.14
IN29
  Bottom 0.254: U30.2 27.34,58.67 28.35,59.69 30.39,59.69 JP1.10
IN30
  Bottom 0.254: JP1.8 28.86,60.71 25.69,60.71 23.27,58.29 U31.2
IN31
  Bottom 0.254: JP1.6 27.34,61.72 20.99,61.72 19.21,59.94 U32.2
IN32
  Bottom 0.254: U33.2 80.04,18.8 77.76,21.08 70.52,21.08 JP2.3
IN33
  Bottom 0.254: U34.2 75.98,16.51 73.95,18.54 67.98,18.54 JP2.5
IN34
  Bottom 0.254: U35.2 71.92,16.89 71.28,17.53 66.45,17.53 JP2.7
IN35
  Bottom 0.254: JP2.9 64.93,16.51 66.93,16.51 67.85,15.59 U36.2
IN36
  Bottom 0.254: JP2.13 58.71,17.65 61.59,17.65 63.79,15.46 U37.2
IN37
  Bottom 0.254: JP2.15 57.06,16.76 58.07,16.76 59.72,15.11 U38.2
IN38
  Bottom 0.254: U39.2 55.66,15.37 55.66,15.62 JP2.17
IN39
  Bottom 0.254: JP2.19 48.93,19.14 51.59,16.48 U40.2
IN40
  Bottom 0.254: JP2.21 46.39,17.62 47.53,16.48 U41.2
IN41
  Bottom 0.254: JP2.23 43.85,15.91 43.56,15.62 43.56,14.79 U42.2
IN42
  Bottom 0.254: U43.2 39.53,15.49 41.31,17.27 JP2.25
IN43
  Bottom 0.254: U44.2 35.47,15.24 38.77,18.54 JP2.27
IN44
  Bottom 0.254: U45.2 31.4,15.37 33.69,17.65 JP2.31
IN45
  Bottom 0.254: U46.2 27.34,15.11 31.15,18.92 JP2.33
IN46
  Bottom 0.254: U47.2 23.27,15.88 24.93,17.53 27.3,17.53 28.61,18.83 JP2.35
IN47
  Bottom 0.254: U48.2 19.21,16.76 20.99,18.54 25.4,18.54 26.07,19.21 JP2.37
IN48
  Bottom 0.254: U49.2 15.27,25.4 18.32,22.35 19.46,22.35 JP2.40
IN49
  Bottom 0.254: U50.2 19.34,25.78 20.48,24.64 23.53,24.64 25.81,22.35 JP2.38
IN50
  Bottom 0.254: U51.2 23.4,26.04 23.78,25.65 25.05,25.65 28.35,22.35 JP2.36
IN51
  Bottom 0.254: U52.2 27.46,25.4 30.51,22.35 JP2.34
IN52
  Bottom 0.254: JP2.32 31.53,24.51 U53.2
IN53
  Bottom 0.254: JP2.28 38.77,22.61 36.1,25.27 35.59,25.78 U54.2
IN54
  Bottom 0.254: JP2.26 41.31,24 39.66,25.65 U55.2
IN55
  Bottom 0.254: JP2.24 43.85,27.03 arc90 U56.2
IN56
  Bottom 0.254: U57.2 47.78,26.04 46.39,24.64 JP2.22
IN57
  Bottom 0.254: U58.2 51.72,25.4 51.72,25.15 JP2.20
IN58
  Bottom 0.254: JP2.18 55.79,26.67 U59.2
IN59
  Bottom 0.254: U60.2 59.85,26.04 59.22,25.4 57.69,25.4 54.64,22.35 JP2.16
IN60
  Bottom 0.254: U61.2 63.91,26.42 61.76,24.26 59.09,24.26 57.18,22.35 JP2.14
IN61
  Bottom 0.254: JP2.10 64.93,25.65 67.57,25.65 67.98,26.06 U62.2
IN62
  Bottom 0.254: U63.2 71.84,26.96 71.84,25.86 70.62,24.64 66.45,24.64 JP2.8
IN63
  Bottom 0.254: U64.2 75.91,26.96 75.91,26.5 73.03,23.62 67.47,23.62 66.71,22.86 JP2.6
N$1
  Bottom 0.381: R8.2 15.32,64.15 35.07,64.15 JP1.12
N$2
  Bottom 0.406: D1.C 11.43,51.04 L2.A
N$3
  Bottom 0.406: L1.C D1.A
N$4
  Top 0.305: R1.1 79.35,50.43 U65.5
N$6
  Top 0.305: U65.2 83.93,48.47 84.52,49.05 84.52,50.39 85.63,51.5 R2.1 85.76,53.68 R3.2
N$7
  Top 0.305: R4.2 R3.1 83.92,53.62 83.92,49.4 83.63,49.12 U65.3
N$9
  Top 0.305: T1.1 79.92,44.45 79.53,44.07 77.76,44.07 77.38,44.45 T1.3
N$10
  Top 0.305: U65.8 78.97,47.82 | T1.2 78.65,47.5 78.97,47.82 | T1.4 76.11,47.5 76.43,47.82 78.97,47.82
N$12
  Top 0.406: LED1.C 8.86,33.02 R5.2
N$13
  Top 0.406: LED2.C R6.2
N$26
  Bottom 0.305: U33.5 U33.6
  Bottom 0.406: C100.1 79.09,10.54 U33.6
N$27
  Bottom 0.305: U34.6 U34.5
  Bottom 0.406: U34.6 75.03,10.54 C101.1
N$28
  Bottom 0.305: U35.5 U35.6
  Bottom 0.406: U35.6 70.97,10.54 C102.1
N$29
  Bottom 0.305: U36.6 U36.5
  Bottom 0.406: U36.6 66.9,10.67 C103.1
N$30
  Bottom 0.305: U37.6 U37.5
  Bottom 0.406: U37.6 62.84,10.67 C104.1
N$31
  Bottom 0.305: U38.6 U38.5
  Bottom 0.406: U38.6 58.77,10.67 C105.1
N$32
  Bottom 0.305: U39.6 U39.5
  Bottom 0.406: U39.6 54.71,10.67 C106.1
N$33
  Bottom 0.305: U40.6 U40.5
  Bottom 0.406: U40.6 50.65,10.67 C107.1
N$34
  Bottom 0.305: U41.6 U41.5
  Bottom 0.406: U41.6 46.58,10.67 C108.1
N$35
  Bottom 0.305: U42.6 U42.5
  Bottom 0.406: U42.6 C109.1
N$36
  Bottom 0.305: U43.6 U43.5
  Bottom 0.406: U43.6 C110.1
N$37
  Bottom 0.406: C111.1 U44.6 U44.5
N$38
  Bottom 0.305: U45.6 U45.5
  Bottom 0.406: U45.6 C112.1
N$39
  Bottom 0.305: U46.6 U46.5
  Bottom 0.406: U46.6 C113.1
N$40
  Bottom 0.305: U47.6 22.39,12.16 U47.5
  Bottom 0.406: U47.6 C114.1
N$41
  Bottom 0.305: U48.6 U48.5
  Bottom 0.406: U48.6 C115.1
N$42
  Bottom 0.305: U17.5 U17.6
  Bottom 0.406: C84.1 79.09,53.21 U17.6
N$43
  Bottom 0.305: U18.6 U18.5
  Bottom 0.406: U18.6 75.03,53.21 C85.1
N$44
  Bottom 0.305: U19.5 U19.6
  Bottom 0.406: U19.6 70.97,53.21 C86.1
N$45
  Bottom 0.305: U20.6 U20.5
  Bottom 0.406: U20.6 66.9,53.34 C87.1
N$46
  Bottom 0.305: U21.6 U21.5
  Bottom 0.406: U21.6 62.84,53.34 C88.1
N$47
  Bottom 0.305: U22.6 U22.5
  Bottom 0.406: U22.6 58.77,53.34 C89.1
N$48
  Bottom 0.305: U23.6 U23.5
  Bottom 0.406: U23.6 54.71,53.34 C90.1
N$49
  Bottom 0.305: U24.6 U24.5
  Bottom 0.406: U24.6 50.65,53.34 C91.1
N$50
  Bottom 0.305: U25.6 U25.5
  Bottom 0.406: U25.6 46.58,53.34 C92.1
N$51
  Bottom 0.305: U26.6 U26.5
  Bottom 0.406: U26.6 C93.1
N$52
  Bottom 0.305: U27.6 U27.5
  Bottom 0.406: U27.6 C94.1
N$53
  Bottom 0.406: C95.1 U28.6 U28.5
N$54
  Bottom 0.305: U29.6 U29.5
  Bottom 0.406: U29.6 C96.1
N$55
  Bottom 0.305: U30.6 U30.5
  Bottom 0.406: U30.6 C97.1
N$56
  Bottom 0.305: U31.6 22.39,54.83 U31.5
  Bottom 0.406: U31.6 C98.1
N$57
  Bottom 0.305: U32.6 U32.5
  Bottom 0.406: U32.6 C99.1
N$58
  Bottom 0.305: U1.5 U1.6
  Bottom 0.406: C68.1 16.22,74.93 U1.6
N$59
  Bottom 0.305: U2.6 U2.5
  Bottom 0.406: U2.6 20.29,74.93 C69.1
N$60
  Bottom 0.305: U3.5 U3.6
  Bottom 0.406: U3.6 24.35,74.93 C70.1
N$61
  Bottom 0.305: U4.6 U4.5
  Bottom 0.406: U4.6 28.41,74.8 C71.1
N$62
  Bottom 0.305: U5.6 U5.5
  Bottom 0.406: U5.6 32.48,74.8 C72.1
N$63
  Bottom 0.305: U6.6 U6.5
  Bottom 0.406: U6.6 36.54,74.8 C73.1
N$64
  Bottom 0.305: U7.6 U7.5
  Bottom 0.406: U7.6 40.61,74.8 C74.1
N$65
  Bottom 0.305: U8.6 U8.5
  Bottom 0.406: U8.6 44.67,74.8 C75.1
N$66
  Bottom 0.305: U9.6 U9.5
  Bottom 0.406: U9.6 48.73,74.8 C76.1
N$67
  Bottom 0.305: U10.6 U10.5
  Bottom 0.406: U10.6 C77.1
N$68
  Bottom 0.305: U11.6 U11.5
  Bottom 0.406: U11.6 C78.1
N$69
  Bottom 0.406: C79.1 U12.6 U12.5
N$70
  Bottom 0.305: U13.6 U13.5
  Bottom 0.406: U13.6 C80.1
N$71
  Bottom 0.305: U14.6 U14.5
  Bottom 0.406: U14.6 C81.1
N$72
  Bottom 0.305: U15.6 72.93,73.31 U15.5
  Bottom 0.406: U15.6 C82.1
N$73
  Bottom 0.305: U16.6 U16.5
  Bottom 0.406: U16.6 C83.1
N$146
  Bottom 0.305: U49.5 U49.6
  Bottom 0.406: C116.1 16.22,31.37 U49.6
N$149
  Bottom 0.305: U50.6 U50.5
  Bottom 0.406: U50.6 20.29,31.37 C117.1
N$152
  Bottom 0.305: U51.5 U51.6
  Bottom 0.406: U51.6 24.35,31.37 C118.1
N$155
  Bottom 0.305: U52.6 U52.5
  Bottom 0.406: U52.6 28.41,31.24 C119.1
N$158
  Bottom 0.305: U53.6 U53.5
  Bottom 0.406: U53.6 32.48,31.24 C120.1
N$161
  Bottom 0.305: U54.6 U54.5
  Bottom 0.406: U54.6 36.54,31.24 C121.1
N$164
  Bottom 0.305: U55.6 U55.5
  Bottom 0.406: U55.6 40.61,31.24 C122.1
N$167
  Bottom 0.305: U56.6 U56.5
  Bottom 0.406: U56.6 44.67,31.24 C123.1
N$170
  Bottom 0.305: U57.6 U57.5
  Bottom 0.406: U57.6 48.73,31.24 C124.1
N$173
  Bottom 0.305: U58.6 U58.5
  Bottom 0.406: U58.6 C125.1
N$176
  Bottom 0.305: U59.6 U59.5
  Bottom 0.406: U59.6 C126.1
N$179
  Bottom 0.406: C127.1 U60.6 U60.5
N$182
  Bottom 0.305: U61.6 U61.5
  Bottom 0.406: U61.6 C128.1
N$185
  Bottom 0.305: U62.6 U62.5
  Bottom 0.406: U62.6 C129.1
N$188
  Bottom 0.305: U63.6 72.93,29.75 U63.5
  Bottom 0.406: U63.6 C1130.1
N$191
  Bottom 0.305: U64.6 U64.5
  Bottom 0.406: U64.6 C1131.1
OSCI
  Top 0.305: U66.27 7.54,41.51 4.99,44.07 Q1.1
  Bottom 0.305: C140.1 4.95,44.28 Q1.1
OSCO
  Top 0.305: U66.28 6.98,39.24 Q1.2
  Bottom 0.305: C139.1 4.95,39.28 Q1.2
OUT0
  Bottom 0.406: C68.2 14.2,76.52 16.67,78.99 SV1.1
OUT1
  Bottom 0.406: SV1.3 28.99,77.85 19.59,77.85 18.26,76.52 C69.2
OUT2
  Bottom 0.406: SV1.5 30.92,77.24 23.93,77.24 22.32,75.63 C70.2
OUT3
  Bottom 0.406: SV1.7 33.81,77.6 32.16,77.6 31.2,76.63 27.72,76.63 26.39,75.3 C71.2
OUT4
  Bottom 0.406: SV1.9 36.23,77.47 34.7,77.47 34.07,76.83 32.28,76.83 30.45,75 C72.2
OUT5
  Bottom 0.406: SV1.11 38.9,77.6 37.37,77.6 36.61,76.83 35.47,76.83 34.52,75.89 C73.2
OUT6
  Bottom 0.406: SV1.13 41.31,77.47 40.29,77.47 38.58,75.76 C74.2
OUT7
  Bottom 0.406: SV1.15 42.64,76.27 C75.2
OUT8
  Bottom 0.406: C76.2 46.71,77.79 SV1.17
OUT9
  Bottom 0.406: SV1.19 50.45,75.25 C77.2
OUT10
  Bottom 0.406: SV1.21 52.99,77.72 54.84,75.88 C78.2
OUT11
  Bottom 0.406: SV1.23 58.9,75.63 C79.2
OUT12
  Bottom 0.406: SV1.25 60.1,76.96 61.12,76.96 62.96,75.12 C80.2
OUT13
  Bottom 0.406: SV1.27 61.88,77.72 63.41,77.72 64.04,77.09 66.33,77.09 67.03,76.39 C81.2
OUT14
  Bottom 0.406: SV1.29 64.3,77.85 69.76,77.85 71.09,76.52 C82.2
OUT15
  Bottom 0.406: SV1.31 74.07,78.99 75.16,77.91 C83.2
OUT16
  Bottom 0.406: SV2.1 80.04,48.77 81.12,49.84 C84.2
OUT17
  Bottom 0.406: SV2.3 66.33,49.91 76.49,49.91 77.06,50.48 C85.2
OUT18
  Bottom 0.406: SV2.5 63.91,50.04 64.93,50.04 65.44,50.04 65.95,50.55 72.17,50.55 72.99,51.37 C86.2
OUT19
  Bottom 0.406: SV2.7 61.37,50.04 63.02,50.04 63.66,50.67 65.18,50.67 65.67,51.16 67.32,51.16 68.93,52.77 C87.2
OUT20
  Bottom 0.406: SV2.9 58.71,49.91 60.36,49.91 61.12,50.67 62.8,50.67 64.86,52.74 C88.2
OUT21
  Bottom 0.406: SV2.11 56.17,49.91 57.56,49.91 58.33,50.67 59.6,50.67 60.8,51.88 C89.2
OUT22
  Bottom 0.406: SV2.13 54.26,50.55 55.53,50.55 56.74,51.75 C90.2
OUT23
  Bottom 0.406: SV2.15 52.67,51.5 C91.2
OUT24
  Bottom 0.406: SV2.17 47.4,50.67 48.61,51.88 C92.2
OUT25
  Bottom 0.406: SV2.19 44.54,49.09 C93.2
OUT26
  Bottom 0.406: SV2.21 40.48,50.61 C94.2
OUT27
  Bottom 0.406: SV2.23 38.39,50.16 37.5,50.16 36.42,51.25 C95.2
OUT28
  Bottom 0.406: SV2.25 35.97,50.04 34.45,50.04 32.35,52.14 C96.2
OUT29
  Bottom 0.406: SV2.27 32.93,50.55 28.99,50.55 28.29,51.25 C97.2
OUT30
  Bottom 0.406: SV2.29 31.02,49.91 25.31,49.91 24.22,50.99 C98.2
OUT31
  Bottom 0.406: SV2.31 21.11,48.77 20.16,49.72 C99.2
OUT32
  Bottom 0.406: SV3.1 79.79,6.48 81.12,7.81 C100.2
OUT33
  Bottom 0.406: SV3.3 66.33,7.62 76.11,7.62 77.06,8.57 C101.2
OUT34
  Bottom 0.406: SV3.5 64.4,8.23 72.14,8.23 72.99,9.08 C102.2
OUT35
  Bottom 0.406: SV3.7 61.5,7.87 63.18,7.87 64.14,8.84 67.93,8.84 68.93,9.84 C103.2
OUT36
  Bottom 0.406: SV3.9 58.96,7.87 60.36,7.87 61.12,8.64 63.08,8.64 63.89,9.45 63.91,9.45 64.86,10.4 C104.2
OUT37
  Bottom 0.406: SV3.11 57.18,8.64 59.09,8.64 60.8,10.35 C105.2
OUT38
  Bottom 0.406: SV3.13 54.13,8.13 55.02,8.13 56.74,9.84 C106.2
OUT39
  Bottom 0.406: SV3.15 52.67,9.21 C107.2
OUT40
  Bottom 0.406: SV3.17 48.61,7.68 C108.2
OUT41
  Bottom 0.406: SV3.19 44.54,6.8 C109.2
OUT42
  Bottom 0.406: SV3.21 40.48,8.32 C110.2
OUT43
  Bottom 0.406: SV3.23 38.13,8.13 37.75,8.13 36.42,9.46 C111.2
OUT44
  Bottom 0.406: SV3.25 35.85,7.87 34.96,7.87 32.35,10.48 C112.2
OUT45
  Bottom 0.406: SV3.27 32.95,8.23 30.39,8.23 28.29,10.33 C113.2
OUT46
  Bottom 0.406: SV3.29 31.02,7.62 25.31,7.62 24.22,8.7 C114.2
OUT47
  Bottom 0.406: SV3.31 21.62,6.48 20.16,7.94 C115.2
OUT48
  Bottom 0.406: SV4.1 27.55,35.4 17.51,35.4 14.2,32.08 C116.2
OUT49
  Bottom 0.406: SV4.3 30.09,35.43 28.89,34.24 19.41,34.24 18.26,33.09 C117.2
OUT50
  Bottom 0.406: SV4.5 31.48,34.24 30.77,34.24 29.99,33.46 23.59,33.46 22.26,32.13 22.32,32.06 C118.2
OUT51
  Bottom 0.406: SV4.7 35.21,34.8 34.04,33.63 31.02,33.63 30.03,32.64 26.7,32.64 26.39,32.32 C119.2
OUT52
  Bottom 0.406: SV4.9 37.75,35.31 36.23,33.78 35.09,33.78 34.32,33.02 31.27,33.02 30.45,32.2 C120.2
OUT53
  Bottom 0.406: C121.2 34.96,31.81 34.96,32.51 35.47,33.02 37.88,33.02 SV4.11
OUT54
  Bottom 0.406: C122.2 39.02,31.81 39.02,32.38 42.07,35.43 SV4.13
OUT55
  Bottom 0.406: C123.2 42.64,31.69 45.37,34.42 SV4.15
OUT56
  Bottom 0.406: C124.2 46.71,31.94 47.91,33.15 SV4.17
OUT57
  Bottom 0.406: C125.2 50.45,31.69 SV4.19
OUT58
  Bottom 0.406: C126.2 52.99,33.21 SV4.21
OUT59
  Bottom 0.406: C127.2 55.53,34.74 SV4.23
OUT60
  Bottom 0.406: C128.2 61.57,32.77 60.74,32.77 SV4.25
OUT61
  Bottom 0.406: SV4.27 60.65,35.43 63.06,33.02 65.38,33.02 C129.2
OUT62
  Bottom 0.406: SV4.29 63.28,35.31 63.28,35.28 64.3,34.27 69.47,34.27 71.03,32.7 71.03,31.43 C1130.2
OUT63
  Bottom 0.406: SV4.31 72.62,35.43 75.16,32.89 C1131.2
RX
  Top 0.305: U66.5 17.08,43.46 17.69,44.07 17.69,51.69 15.15,54.23 15.15,59.94 18.05,62.85 18.19,62.99 20.73,65.53 JP1.1
TX
  Top 0.305: U66.1 17.02,40.86 18.32,42.16 18.32,51.82 15.78,54.36 15.78,59.82 17.67,61.71 17.69,61.72 18.96,62.99 JP1.2
VBUS  (via drill 0.4)
  Top 0.406: 11.01,58.88 11.47,58.88 C138.1 | v11.46,58.42 11.01,58.88 | 11.01,58.88 X1.1
  Bottom 0.381: v11.46,58.42 14.2,61.15 R8.1
  Bottom 0.406: L1.A v11.46,58.42
VCC  (via drill 0.4)
  Top 0.305: U66.20 12.82,46.06 13.49,46.74 v13.49,47.88
  Bottom 0.406: C137.1 15.59,52.07 C141.+ 13.37,49.82 L2.C 13.53,47.91 v13.49,47.88
VDD  (via drill 0.4, 1.02, 1.02 pad 0.61)
  Top 0.406: U65.7 75.81,48.47 v73.95,46.61
  Top 0.61: T1.6 T1.5 | C49.1 13.24,26.22 | 13.24,26.22 C50.1 17.43,26.22 | 17.43,26.22 C51.1 21.5,26.22 | 21.5,26.22 C52.1 25.56,26.22 | 25.56,26.22 C53.1 29.62,26.22 | 29.62,26.22 C54.1 33.69,26.22 | 33.69,26.22 C55.1 37.75,26.22 | 37.75,26.22 C56.1 41.82,26.22 | 41.82,26.22 C57.1 45.88,26.22 | 45.88,26.22 C58.1 49.82,26.22 | 49.82,26.22 C59.1 53.88,26.22 | 53.88,26.22 C60.1 57.95,26.22 | 57.95,26.22 C61.1 62.01,26.22 | 62.01,26.22 C62.1 66.07,26.22 | 66.07,26.22 C63.1 70.14,26.22 | 70.14,26.22 C64.1 73.88,26.22 | v70.14,27.05 70.14,26.22 | v66.07,27.05 66.07,26.22 | v62.01,27.05 62.01,26.22 | v57.95,27.05 57.95,26.22 | v53.88,27.05 53.88,26.22 | v49.82,27.05 49.82,26.22 | v45.88,27.05 45.88,26.22 | v41.82,27.05 41.82,26.22 | v33.69,27.05 33.69,26.22 | v37.75,27.05 37.75,26.22 | v29.62,27.05 29.62,26.22 | v25.56,27.05 25.56,26.22 | v21.5,27.05 21.5,26.22 | v17.43,27.05 17.43,26.22 | v13.37,27.05 13.37,26.35 13.24,26.22 | 73.88,26.22 74.2,26.54 v74.2,27.05 | 73.88,26.22 78.45,26.22 v78.52,26.29 | C33.1 82.08,15.69 | 82.08,15.69 C34.1 77.88,15.69 | 77.88,15.69 C35.1 73.82,15.69 | 73.82,15.69 C36.1 69.76,15.69 | 69.76,15.69 C37.1 65.69,15.69 | 65.69,15.69 C38.1 61.63,15.69 | 61.63,15.69 C39.1 57.56,15.69 | 57.56,15.69 C40.1 53.5,15.69 | 53.5,15.69 C41.1 49.44,15.69 | 49.44,15.69 C42.1 45.5,15.69 | 45.5,15.69 C43.1 41.44,15.69 | 41.44,15.69 C44.1 37.37,15.69 | 37.37,15.69 C45.1 33.31,15.69 | 33.31,15.69 C46.1 29.24,15.69 | 29.24,15.69 C47.1 25.18,15.69 | 25.18,15.69 C48.1 21.18,15.69 | v25.18,14.86 25.18,15.69 | v29.24,14.86 29.24,15.69 | v33.31,14.86 33.31,15.69 | v37.37,14.86 37.37,15.69 | v41.44,14.86 41.44,15.69 | v45.5,14.86 45.5,15.69 | v49.44,14.86 49.44,15.69
  Top 0.61: v53.5,14.86 53.5,15.69 | v61.63,14.86 61.63,15.69 | v57.56,14.86 57.56,15.69 | v65.69,14.86 65.69,15.69 | v69.76,14.86 69.76,15.69 | v73.82,14.86 73.82,15.69 | v77.88,14.86 77.88,15.69 | v81.95,14.86 81.95,15.56 82.08,15.69 | 21.18,15.69 21.11,15.62 v21.11,14.99 | v16.8,15.62 16.86,15.69 21.18,15.69 | C17.1 82.08,58.36 | 82.08,58.36 C18.1 77.88,58.36 | 77.88,58.36 C19.1 73.82,58.36 | 73.82,58.36 C20.1 69.76,58.36 | 69.76,58.36 C21.1 65.69,58.36 | 65.69,58.36 C22.1 61.63,58.36 | 61.63,58.36 C23.1 57.56,58.36 | 57.56,58.36 C24.1 53.5,58.36 | 53.5,58.36 C25.1 49.44,58.36 | 49.44,58.36 C26.1 45.5,58.36 | 45.5,58.36 C27.1 41.44,58.36 | 41.44,58.36 C28.1 37.37,58.36 | 37.37,58.36 C29.1 33.31,58.36 | 33.31,58.36 C30.1 29.24,58.36 | 29.24,58.36 C31.1 25.18,58.36 | 25.18,58.36 C32.1 21.43,58.36 | v25.18,57.53 25.18,58.36 | v29.24,57.53 29.24,58.36 | v33.31,57.53 33.31,58.36 | v37.37,57.53 37.37,58.36 | v41.44,57.53 41.44,58.36 | v45.5,57.53 45.5,58.36 | v49.44,57.53 49.44,58.36 | v53.5,57.53 53.5,58.36 | v61.63,57.53 61.63,58.36 | v57.56,57.53 57.56,58.36 | v65.69,57.53 65.69,58.36 | v69.76,57.53 69.76,58.36 | v73.82,57.53 73.82,58.36 | v77.88,57.53 77.88,58.36 | v81.95,57.53 81.95,58.23 82.08,58.36 | 21.43,58.36 21.11,58.04 v21.11,57.53 | 21.43,58.36 16.86,58.36 v16.8,58.29 | 17.43,69.78 C2.1 13.88,69.78 13.37,70.29 v13.37,70.61 | 17.43,69.78 C3.1 21.5,69.78 | 21.5,69.78 C4.1 25.56,69.78 | 25.56,69.78 C5.1 29.62,69.78 | 29.62,69.78 C6.1 33.69,69.78 | 33.69,69.78 C7.1 37.75,69.78 | 37.75,69.78 C8.1 41.82,69.78 | 41.82,69.78 C9.1 45.88,69.78 | 45.88,69.78 C10.1 49.82,69.78 | 49.82,69.78 C11.1 53.88,69.78 | 53.88,69.78 C12.1 57.95,69.78 | 62.01,69.78 C14.1 66.07,69.78
  Top 0.61: 66.07,69.78 C15.1 70.14,69.78 | 70.14,69.78 C16.1 73.88,69.78 | v70.14,70.61 70.14,69.78 | v66.07,70.61 66.07,69.78 | v62.01,70.61 62.01,69.78 | v57.95,70.61 57.95,69.78 | v53.88,70.61 53.88,69.78 | v49.82,70.61 49.82,69.78 | v45.88,70.61 45.88,69.78 | v41.82,70.61 41.82,69.78 | v33.69,70.61 33.69,69.78 | v37.75,70.61 37.75,69.78 | v29.62,70.61 29.62,69.78 | v25.56,70.61 25.56,69.78 | v21.5,70.61 21.5,69.78 | v17.43,70.61 17.43,69.78 | 73.88,69.78 74.2,70.1 v74.2,70.61 | 73.88,69.78 78.45,69.78 v78.52,69.85 | 57.95,69.78 C13.1 62.01,69.78
  Top 1.016: T1.5 74.22,40.71 v74.2,40.69
  pour Bottom: 87.81,73.41 13.88,73.41 5.66,65.19 5.66,18.63 11.59,12.7 81.69,12.7 90.61,21.62 90.61,54.33 90.61,70.61
VIN
  Top 0.305: U65.1 84.61,47.82 85.76,48.96 R2.2 | U65.1 82.57,47.86 81.72,47.86 81.25,48.33 R1.2 | T1.8 81.51,40.71 82.58,41.78 82.58,47.79 U65.1
  Top 0.381: 82.73,41.76 82.61,41.88 U65.1 | T1.7 T1.8
  Top 0.508: 82.73,41.76 83.6,41.76 J1.1

## Text on the board
tPlace: CH0 | CH15 | CH31 | CH16 | TX | CH48 | CH63 | RX | FPGA | ENABLE | CH47 | CH32 | GND
bPlace: 1uF
tDocu: Shield / v 1.1